# Altium project NeuroBB.PrjPcb
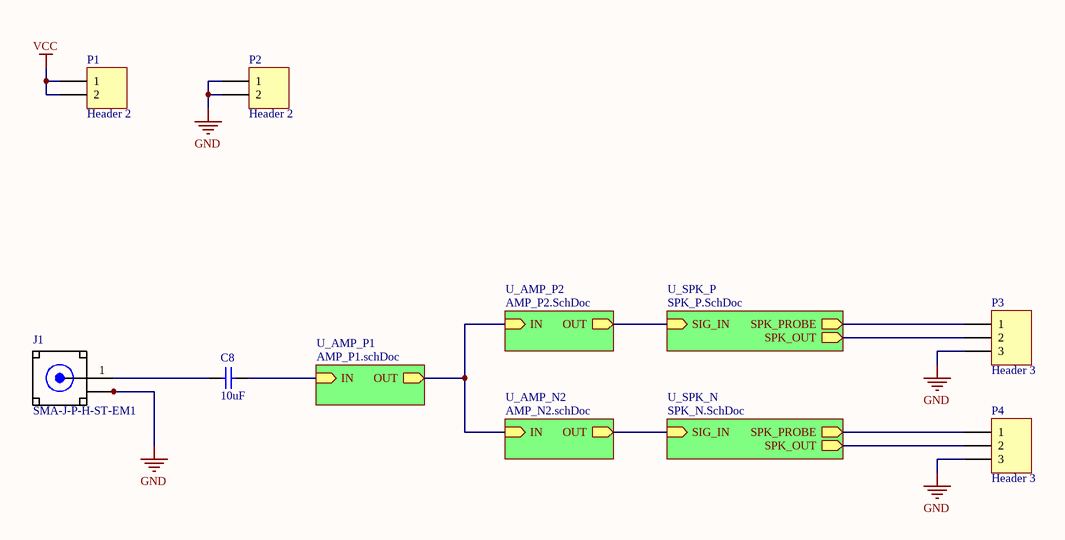
[diagram p0: NeuroBB.SchDoc]
6 sheets, 60 parts. Net scope: hierarchical (ports join the sheet entries above them; power ports are global).
Board file: NeuroBB_B.PcbDoc
Sheets:
  NeuroBB.SchDoc
    U_AMP_P1 = AMP_P1.schDoc
    U_AMP_N2 = AMP_N2.schDoc
    U_AMP_P2 = AMP_P2.SchDoc
    U_SPK_P = SPK_P.SchDoc
    U_SPK_N = SPK_N.SchDoc

## Sheet NeuroBB.SchDoc
size A; SheetNumber: 1; SheetTotal: 6

### Parts
C8  10uF  [SMD-0603]
J1  SMA-J-P-H-ST-EM1  [SMA-J-P-H-ST-EM1]
P1  Header 2  [HDR1X2]
P2  Header 2  [HDR1X2]
P3  Header 3  [HDR1X3]
P4  Header 3  [HDR1X3]

### Sub-sheets
U_AMP_N2 = AMP_N2.schDoc: OUT (out), IN (in)
U_AMP_P1 = AMP_P1.schDoc: OUT (out), IN (in)
U_AMP_P2 = AMP_P2.SchDoc: OUT (out), IN (in)
U_SPK_N = SPK_N.SchDoc: SPK_OUT (out), SIG_IN (in), SPK_PROBE (out)
U_SPK_P = SPK_P.SchDoc: SPK_OUT (out), SIG_IN (in), SPK_PROBE (out)

### Nets
GND: J1.2_1(GND) J1.2_2(GND) J1.3_1(GND) J1.3_2(GND) P2.1 P2.2 P3.3 P4.3
VCC: P1.1 P1.2
VBias2: sheet U_AMP_P1/OUT, sheet U_AMP_N2/IN, sheet U_AMP_P2/IN
VBias3: C8.2 ; sheet U_AMP_P1/IN
NetC2_2: sheet U_AMP_N2/OUT, sheet U_SPK_N/SIG_IN
NetC6_1: sheet U_AMP_P2/OUT, sheet U_SPK_P/SIG_IN
NetC8_1: C8.1 J1.1(SIGNAL)
NetP3_1: P3.1 ; sheet U_SPK_P/SPK_PROBE
NetP3_2: P3.2 ; sheet U_SPK_P/SPK_OUT
NetP4_1: P4.1 ; sheet U_SPK_N/SPK_PROBE
NetP4_2: P4.2 ; sheet U_SPK_N/SPK_OUT

### Library data of the parts
C8 = CAP0603: Ceramic Capacitor 0603
J1 = SMA-J-P-H-ST-EM1: Connector SMA F 50Ohm Solder ST Edge Mount Gold Over Nickel Tray; MF: Samtec; Price: None; SnapEDA_Link: https://www.snapeda.com/parts/SMA-J-P-H-ST-EM1/Samtec%20Inc./view-part/?ref=snap; MP: SMA-J-P-H-ST-EM1; Package: None; Availability: Unavailable; Value: *
P1 P2 = Header 2: Header, 2-Pin; LatestRevisionDate: 17-Jul-2002; LatestRevisionNote: Re-released for DXP Platform.; Publisher: Altium Limited
P3 P4 = Header 3: Header, 3-Pin; LatestRevisionDate: 17-Jul-2002; LatestRevisionNote: Re-released for DXP Platform.; Publisher: Altium Limited

## Sheet AMP_P1.schDoc
size A; SheetNumber: 3; SheetTotal: 6
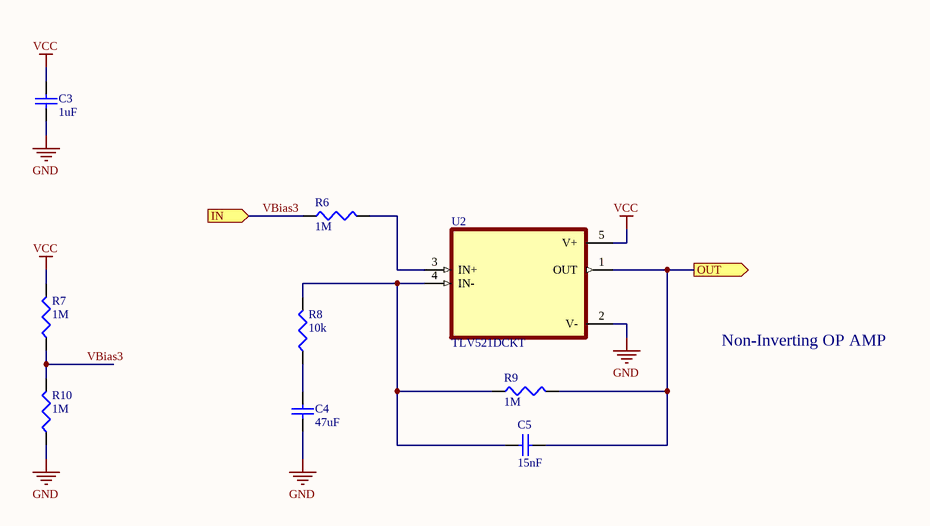
[diagram p1: AMP_P1.schDoc]

### Parts
C3  1uF  [SMD-0603]
C4  47uF  [SMD-0603]
C5  15nF  [SMD-0603]
R6  1M  [SMD-0603]
R7  1M  [SMD-0603]
R8  10k  [SMD-0603]
R9  1M  [SMD-0603]
R10  1M  [SMD-0603]
U2  TLV521DCKT  [TLV521-SOT-5N]

### Ports
IN (in), OUT (out)

### Nets
GND: C3.1 C4.1 R10.1 U2.2(V-)
VCC: C3.2 R7.2 U2.5(V+)
VBias2: C5.2 R9.2 U2.1(OUT) ; port OUT
VBias3: R6.1 R7.1 R10.2 ; port IN
NetC4_2: C4.2 R8.1
NetC5_1: C5.1 R8.2 R9.1 U2.4(IN-)
NetR6_2: R6.2 U2.3(IN+)

### Notes on the sheet
- Non-Inverting OP AMP

### Library data of the parts
C3-C5 = CAP0603: Ceramic Capacitor 0603
R6-R10 = RES0603: Resistor-0603
U2 = TLV521DCKT: 350-nA Nanopower, Single, RRIO, CMOS Input, Operational Amplifier for Cost-Sensitive Systems 5-SC70 -40 to 125; MF: Texas Instruments; DigiKey-Purchase-URL: https://snapeda.com/shop?store=DigiKey&id=809196; Package: SOT-SC70-5 Texas Instruments; Mouser-Purchase-URL: https://snapeda.com/shop?store=Mouser&id=809196; Value: *; Arrow_Electronics-Purchase-URL: https://snapeda.com/shop?store=Arrow+Electronics&id=809196; Texas_Instruments-Purchase-URL: https://snapeda.com/shop?store=Texas+Instruments&id=809196; SnapEDA_Link: https://www.snapeda.com/parts/TLV521DCKT/Texas%20Instruments/view-part/809196/?ref=snap; Availability: Unavailable; Price: None; MP: TLV521DCKT

## Sheet AMP_N2.schDoc
size A; SheetNumber: 2; SheetTotal: 6
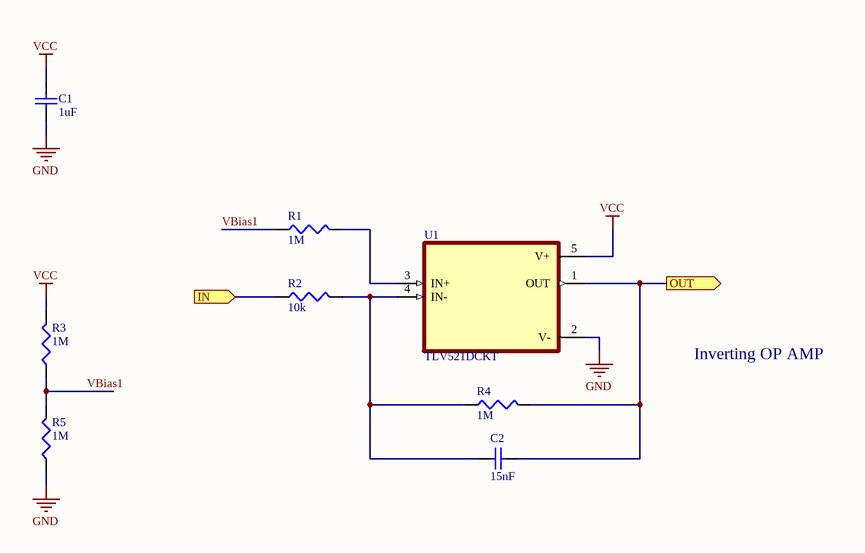
[diagram p2: AMP_N2.schDoc]

### Parts
C1  1uF  [SMD-0603]
C2  15nF  [SMD-0603]
R1  1M  [SMD-0603]
R2  10k  [SMD-0603]
R3  1M  [SMD-0603]
R4  1M  [SMD-0603]
R5  1M  [SMD-0603]
U1  TLV521DCKT  [TLV521-SOT-5N]

### Ports
IN (in), OUT (out)

### Nets
GND: C1.1 R5.1 U1.2(V-)
VCC: C1.2 R3.2 U1.5(V+)
VBias1: R1.1 R3.1 R5.2
VBias2: R2.1 ; port IN
NetC2_1: C2.1 R2.2 R4.1 U1.4(IN-)
NetC2_2: C2.2 R4.2 U1.1(OUT) ; port OUT
NetR1_2: R1.2 U1.3(IN+)

### Notes on the sheet
- Inverting OP AMP

### Library data of the parts
C1 C2 = CAP0603: Ceramic Capacitor 0603
R1-R5 = RES0603: Resistor-0603
U1 = TLV521DCKT: as U2 on sheet AMP_P1; DigiKey-Purchase-URL: https://snapeda.com/shop?store=DigiKey&id=809196; Package: SOT-SC70-5 Texas Instruments; Mouser-Purchase-URL: https://snapeda.com/shop?store=Mouser&id=809196; Value: *; Arrow_Electronics-Purchase-URL: https://snapeda.com/shop?store=Arrow+Electronics&id=809196; Texas_Instruments-Purchase-URL: https://snapeda.com/shop?store=Texas+Instruments&id=809196; SnapEDA_Link: https://www.snapeda.com/parts/TLV521DCKT/Texas%20Instruments/view-part/809196/?ref=snap; Availability: Unavailable; Price: None; MP: TLV521DCKT

## Sheet AMP_P2.SchDoc
size A; SheetNumber: 5; SheetTotal: 6
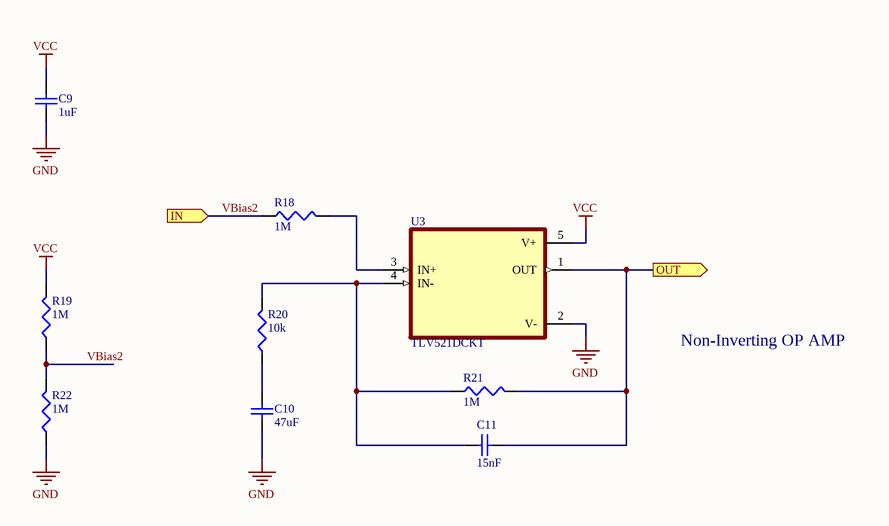
[diagram p3: AMP_P2.SchDoc]

### Parts
C9  1uF  [SMD-0603]
C10  47uF  [SMD-0603]
C11  15nF  [SMD-0603]
R18  1M  [SMD-0603]
R19  1M  [SMD-0603]
R20  10k  [SMD-0603]
R21  1M  [SMD-0603]
R22  1M  [SMD-0603]
U3  TLV521DCKT  [TLV521-SOT-5N]

### Ports
IN (in), OUT (out)

### Nets
GND: C9.1 C10.1 R22.1 U3.2(V-)
VCC: C9.2 R19.2 U3.5(V+)
VBias2: R18.1 R19.1 R22.2 ; port IN
NetC6_1: C11.2 R21.2 U3.1(OUT) ; port OUT
NetC10_2: C10.2 R20.1
NetC11_1: C11.1 R20.2 R21.1 U3.4(IN-)
NetR18_2: R18.2 U3.3(IN+)

### Notes on the sheet
- Non-Inverting OP AMP

### Library data of the parts
C9-C11 = CAP0603: Ceramic Capacitor 0603
R18-R22 = RES0603: Resistor-0603
U3 = TLV521DCKT: as U2 on sheet AMP_P1; DigiKey-Purchase-URL: https://snapeda.com/shop?store=DigiKey&id=809196; Package: SOT-SC70-5 Texas Instruments; Mouser-Purchase-URL: https://snapeda.com/shop?store=Mouser&id=809196; Value: *; Arrow_Electronics-Purchase-URL: https://snapeda.com/shop?store=Arrow+Electronics&id=809196; Texas_Instruments-Purchase-URL: https://snapeda.com/shop?store=Texas+Instruments&id=809196; SnapEDA_Link: https://www.snapeda.com/parts/TLV521DCKT/Texas%20Instruments/view-part/809196/?ref=snap; Availability: Unavailable; Price: None; MP: TLV521DCKT

## Sheet SPK_P.SchDoc
size A; SheetNumber: 4; SheetTotal: 6; SPICEModelCacheEZHXWKXH: <root> / <DocumentId>EZHXWKXH</DocumentId> / <CacheFrame Number="0"> / <Model Name="2n3904" Kind="MDL"> / <Text>*2N3904 / *Si 310mW  40V 200mA 300MHz pkg:TO-92B 1,2,3 / .MODEL 2N3904 NPN(IS=1.4E-14 BF=300 VAF=100 IKF=0.025 ISE=3E-13 / + BR=7.5 RC=2.4 CJE=4.5E-12 TF=4E-10 CJC=3.5E-12 TR=2.1E-8 XTB=1.5 KF=9E-16 )</Text> / </Model> / <Model Name="2n3906" Kind="MDL"> / <Text>*2N3906 / *Si 310mW  40V 200mA 250MHz pkg:TO-92B 1,2,3 / .MODEL 2N3906 PNP(IS=4E-14 BF=400 VAF=50 IKF=0.02 ISE=7E-15 NE=1.16 / + BR=7.5 RC=2.4 CJE=6.3E-12 VJE=0.75 TF=5E-10 CJC=5.8E-12 VJC=0.75 TR=2.3E-8 / + VJS=0.75 XTB=1.5 KF=6E-16 )</Text> / </Model> / </CacheFrame> / </root>
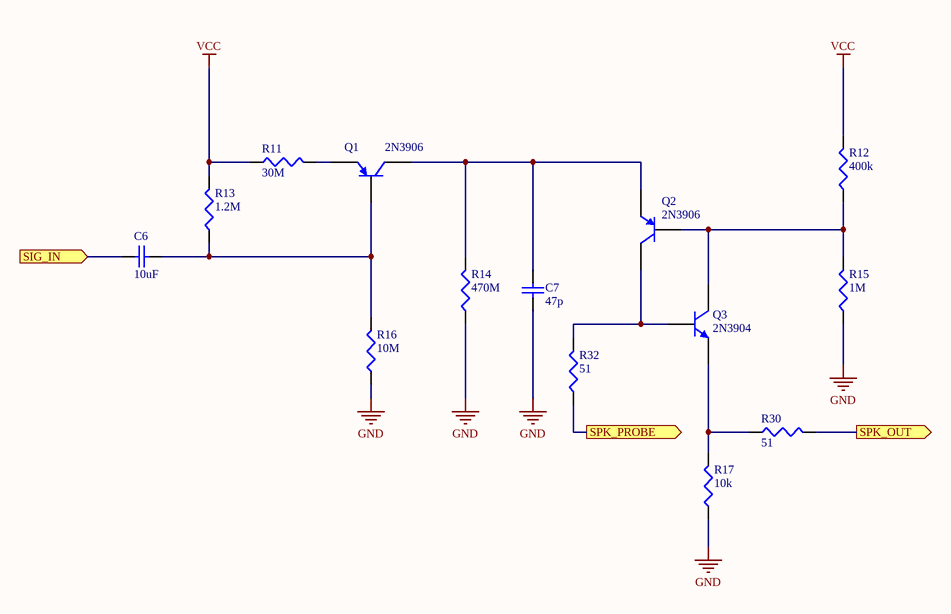
[diagram p4: SPK_P.SchDoc]

### Parts
C6  10uF  [SMD-0603]
C7  47p  [SMD-0603]
Q1  2N3906  [TO-92A]
Q2  2N3906  [TO-92A]
Q3  2N3904  [TO-92A]
R11  30M  [SMD-0603]
R12  400k  [SMD-0603]
R13  1.2M  [SMD-0603]
R14  470M  [SMD-0603]
R15  1M  [SMD-0603]
R16  10M  [SMD-0603]
R17  10k  [SMD-0603]
R30  51  [SMD-0603]
R32  51  [SMD-0603]

### Ports
SIG_IN (in), SPK_OUT (out), SPK_PROBE (out)

### Nets
GND: C7.1 R14.1 R15.1 R16.1 R17.1
VCC: R11.1 R12.2 R13.2
NetC6_1: C6.1 ; port SIG_IN
NetC6_2: C6.2 Q1.2(B) R13.1 R16.2
NetC7_2: C7.2 Q1.3(C) Q2.1(E) R14.2
NetP3_1: R32.1 ; port SPK_PROBE
NetP3_2: R30.2 ; port SPK_OUT
NetQ1_1: Q1.1(E) R11.2
NetQ2_2: Q2.2(B) Q3.3(C) R12.1 R15.2
NetQ2_3: Q2.3(C) Q3.2(B) R32.2
NetQ3_1: Q3.1(E) R17.2 R30.1

### Library data of the parts
C6 C7 = CAP0603: Ceramic Capacitor 0603
Q1 Q2 = 2N3906: PNP General Purpose Amplifier; Published: 8-Jun-2000; LatestRevisionDate: 15-Jan-2003; LatestRevisionNote: PCB Footprint 'BCY-W3/D4.7' replaced; DatasheetVersion: 1997; PackageVersion: Sep-1998; PackageReference: TO-92A; Publisher: Altium Limited; PackageDescription: TO, Flat Index; 3 In-Line, Axial Leads; Body Dia. 4.5mm; Leads 0.51 x 0.48 mm (max); ComponentLink1Description: Manufacturer Link; ComponentLink1URL: http://www.fairchildsemi.com/; ComponentLink2Description: Datasheet; ComponentLink2URL: http://www.fairchildsemi.com/ds/2N%2F2N3906.pdf
Q3 = 2N3904: NPN General Purpose Amplifier; Published: 8-Jun-2000; LatestRevisionDate: 15-Jan-2003; LatestRevisionNote: PCB Footprint 'BCY-W3/D4.7' replaced; DatasheetVersion: 1997; PackageVersion: Sep-1998; PackageReference: TO-92A; Publisher: Altium Limited; PackageDescription: TO, Flat Index; 3 In-Line, Axial Leads; Body Dia. 4.5mm; Leads 0.51 x 0.48 mm (max); ComponentLink1Description: Manufacturer Link; ComponentLink1URL: http://www.fairchildsemi.com/; ComponentLink2Description: Datasheet; ComponentLink2URL: http://www.fairchildsemi.com/ds/2N%2F2N3904.pdf
R11-R17 R30 R32 = RES0603: Resistor-0603

## Sheet SPK_N.SchDoc
size A; SheetNumber: 6; SheetTotal: 6; SPICEModelCacheWYKAUUDH: <root> / <DocumentId>WYKAUUDH</DocumentId> / <CacheFrame Number="0"> / <Model Name="2n3904" Kind="MDL"> / <Text>*2N3904 / *Si 310mW  40V 200mA 300MHz pkg:TO-92B 1,2,3 / .MODEL 2N3904 NPN(IS=1.4E-14 BF=300 VAF=100 IKF=0.025 ISE=3E-13 / + BR=7.5 RC=2.4 CJE=4.5E-12 TF=4E-10 CJC=3.5E-12 TR=2.1E-8 XTB=1.5 KF=9E-16 )</Text> / </Model> / <Model Name="2n3906" Kind="MDL"> / <Text>*2N3906 / *Si 310mW  40V 200mA 250MHz pkg:TO-92B 1,2,3 / .MODEL 2N3906 PNP(IS=4E-14 BF=400 VAF=50 IKF=0.02 ISE=7E-15 NE=1.16 / + BR=7.5 RC=2.4 CJE=6.3E-12 VJE=0.75 TF=5E-10 CJC=5.8E-12 VJC=0.75 TR=2.3E-8 / + VJS=0.75 XTB=1.5 KF=6E-16 )</Text> / </Model> / </CacheFrame> / </root>
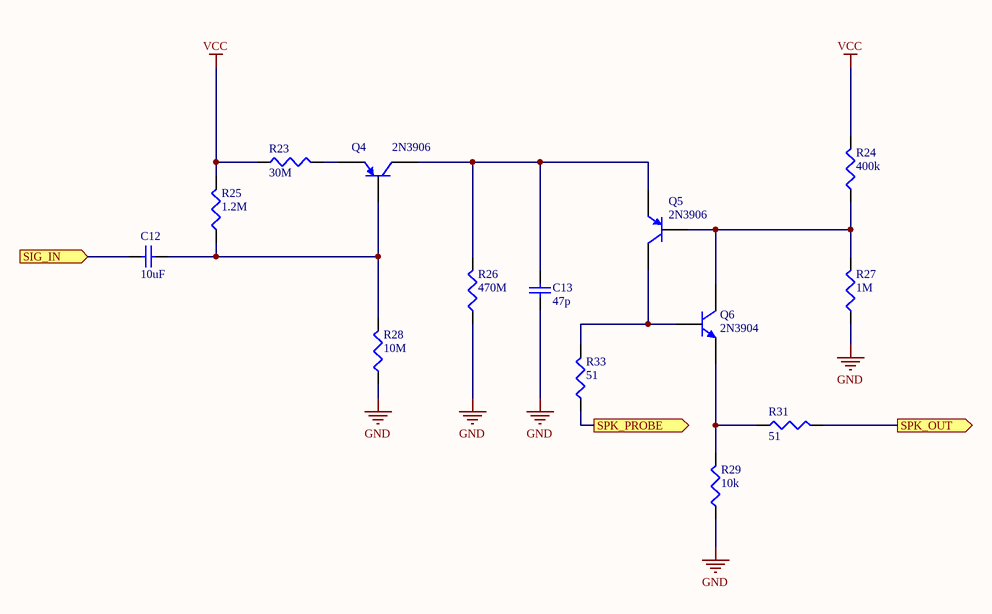
[diagram p5: SPK_N.SchDoc]

### Parts
C12  10uF  [SMD-0603]
C13  47p  [SMD-0603]
Q4  2N3906  [TO-92A]
Q5  2N3906  [TO-92A]
Q6  2N3904  [TO-92A]
R23  30M  [SMD-0603]
R24  400k  [SMD-0603]
R25  1.2M  [SMD-0603]
R26  470M  [SMD-0603]
R27  1M  [SMD-0603]
R28  10M  [SMD-0603]
R29  10k  [SMD-0603]
R31  51  [SMD-0603]
R33  51  [SMD-0603]

### Ports
SIG_IN (in), SPK_OUT (out), SPK_PROBE (out)

### Nets
GND: C13.1 R26.1 R27.1 R28.1 R29.1
VCC: R23.1 R24.2 R25.2
NetC2_2: C12.1 ; port SIG_IN
NetC12_2: C12.2 Q4.2(B) R25.1 R28.2
NetC13_2: C13.2 Q4.3(C) Q5.1(E) R26.2
NetP4_1: R33.1 ; port SPK_PROBE
NetP4_2: R31.2 ; port SPK_OUT
NetQ4_1: Q4.1(E) R23.2
NetQ5_2: Q5.2(B) Q6.3(C) R24.1 R27.2
NetQ5_3: Q5.3(C) Q6.2(B) R33.2
NetQ6_1: Q6.1(E) R29.2 R31.1

### Library data of the parts
C12 C13 = CAP0603: Ceramic Capacitor 0603
Q4 Q5 = 2N3906: PNP General Purpose Amplifier; Published: 8-Jun-2000; LatestRevisionDate: 15-Jan-2003; LatestRevisionNote: PCB Footprint 'BCY-W3/D4.7' replaced; DatasheetVersion: 1997; PackageVersion: Sep-1998; PackageReference: TO-92A; Publisher: Altium Limited; PackageDescription: TO, Flat Index; 3 In-Line, Axial Leads; Body Dia. 4.5mm; Leads 0.51 x 0.48 mm (max); ComponentLink1Description: Manufacturer Link; ComponentLink1URL: http://www.fairchildsemi.com/; ComponentLink2Description: Datasheet; ComponentLink2URL: http://www.fairchildsemi.com/ds/2N%2F2N3906.pdf
Q6 = 2N3904: NPN General Purpose Amplifier; Published: 8-Jun-2000; LatestRevisionDate: 15-Jan-2003; LatestRevisionNote: PCB Footprint 'BCY-W3/D4.7' replaced; DatasheetVersion: 1997; PackageVersion: Sep-1998; PackageReference: TO-92A; Publisher: Altium Limited; PackageDescription: TO, Flat Index; 3 In-Line, Axial Leads; Body Dia. 4.5mm; Leads 0.51 x 0.48 mm (max); ComponentLink1Description: Manufacturer Link; ComponentLink1URL: http://www.fairchildsemi.com/; ComponentLink2Description: Datasheet; ComponentLink2URL: http://www.fairchildsemi.com/ds/2N%2F2N3904.pdf
R23-R29 R31 R33 = RES0603: Resistor-0603

## Nets that join several sheets
GND: NeuroBB (8 pins), AMP_P1 (C3.1 C4.1 R10.1 U2.2), AMP_N2 (C1.1 R5.1 U1.2), AMP_P2 (C9.1 C10.1 R22.1 U3.2), SPK_P (5 pins), SPK_N (5 pins)
VCC: NeuroBB (P1.1 P1.2), AMP_P1 (C3.2 R7.2 U2.5), AMP_N2 (C1.2 R3.2 U1.5), AMP_P2 (C9.2 R19.2 U3.5), SPK_P (R11.1 R12.2 R13.2), SPK_N (R23.1 R24.2 R25.2)
NetC2_2: AMP_N2 (C2.2 R4.2 U1.1), SPK_N (C12.1)
NetC6_1: AMP_P2 (C11.2 R21.2 U3.1), SPK_P (C6.1)
NetP3_1: NeuroBB (P3.1), SPK_P (R32.1)
NetP3_2: NeuroBB (P3.2), SPK_P (R30.2)
NetP4_1: NeuroBB (P4.1), SPK_N (R33.1)
NetP4_2: NeuroBB (P4.2), SPK_N (R31.2)
VBias2: AMP_P1 (C5.2 R9.2 U2.1), AMP_N2 (R2.1), AMP_P2 (R18.1 R19.1 R22.2)
VBias3: NeuroBB (C8.2), AMP_P1 (R6.1 R7.1 R10.2)